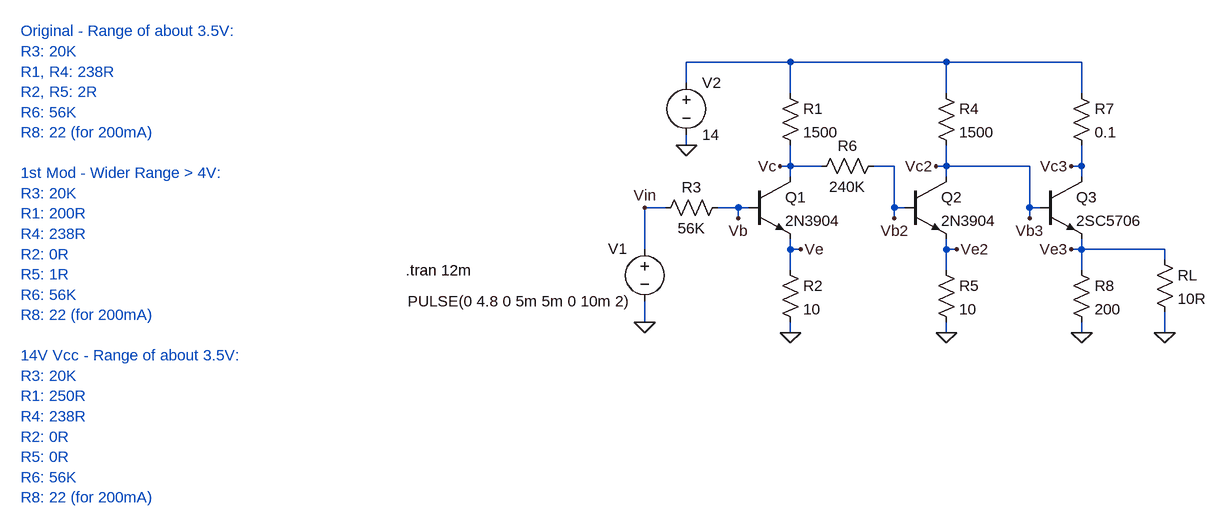
[diagram p0: schematic 2N3904 DC Amplifier  (10mA).asc]
2N3904 DC Amplifier  (10mA).asc, the LTspice schematic file:
Version 4
SHEET 1 1388 680
WIRE 192 -48 32 -48
WIRE 432 -48 192 -48
WIRE 640 -48 432 -48
WIRE 32 -16 32 -48
WIRE 192 0 192 -48
WIRE 432 0 432 -48
WIRE 640 0 640 -48
WIRE 32 80 32 64
WIRE 192 112 192 80
WIRE 192 112 176 112
WIRE 240 112 192 112
WIRE 352 112 320 112
WIRE 432 112 432 80
WIRE 432 112 416 112
WIRE 560 112 432 112
WIRE 640 112 640 80
WIRE 640 112 624 112
WIRE 192 128 192 112
WIRE 432 128 432 112
WIRE 640 128 640 112
WIRE 0 176 -32 176
WIRE 112 176 80 176
WIRE 128 176 112 176
WIRE 352 176 352 112
WIRE 368 176 352 176
WIRE 560 176 560 112
WIRE 576 176 560 176
WIRE 112 192 112 176
WIRE 352 192 352 176
WIRE 560 192 560 176
WIRE -32 240 -32 176
WIRE 192 240 192 224
WIRE 208 240 192 240
WIRE 432 240 432 224
WIRE 448 240 432 240
WIRE 640 240 640 224
WIRE 640 240 624 240
WIRE 768 240 640 240
WIRE 768 256 768 240
WIRE 192 272 192 240
WIRE 432 272 432 240
WIRE 640 272 640 240
WIRE -32 352 -32 320
WIRE 192 368 192 352
WIRE 432 368 432 352
WIRE 640 368 640 352
WIRE 768 368 768 336
FLAG 32 80 0
FLAG -32 352 0
FLAG 192 368 0
FLAG 176 112 Vc
FLAG 208 240 Ve
FLAG 112 192 Vb
FLAG -32 176 Vin
FLAG 432 368 0
FLAG 416 112 Vc2
FLAG 448 240 Ve2
FLAG 352 192 Vb2
FLAG 640 368 0
FLAG 624 112 Vc3
FLAG 624 240 Ve3
FLAG 560 192 Vb3
FLAG 768 368 0
SYMBOL npn 128 128 R0
SYMATTR InstName Q1
SYMATTR Value 2N3904
SYMBOL voltage -32 224 R0
WINDOW 0 -56 15 Left 2
WINDOW 3 -365 96 Left 2
WINDOW 123 -382 125 Left 2
WINDOW 39 0 0 Left 0
SYMATTR InstName V1
SYMATTR Value PULSE(0 4.8 0 5m 5m 0 10m 2)
SYMBOL voltage 32 -32 R0
WINDOW 123 0 0 Left 0
WINDOW 39 0 0 Left 0
SYMATTR InstName V2
SYMATTR Value 14
SYMBOL res 176 -16 R0
SYMATTR InstName R1
SYMATTR Value 1500
SYMBOL res 96 160 R90
WINDOW 0 0 56 VBottom 2
WINDOW 3 32 56 VTop 2
SYMATTR InstName R3
SYMATTR Value 56K
SYMBOL res 176 256 R0
SYMATTR InstName R2
SYMATTR Value 10
SYMBOL npn 368 128 R0
SYMATTR InstName Q2
SYMATTR Value 2N3904
SYMBOL res 416 -16 R0
SYMATTR InstName R4
SYMATTR Value 1500
SYMBOL res 416 256 R0
SYMATTR InstName R5
SYMATTR Value 10
SYMBOL res 336 96 R90
WINDOW 0 0 56 VBottom 2
WINDOW 3 32 56 VTop 2
SYMATTR InstName R6
SYMATTR Value 240K
SYMBOL npn 576 128 R0
SYMATTR InstName Q3
SYMATTR Value 2SC5706
SYMBOL res 624 -16 R0
SYMATTR InstName R7
SYMATTR Value 0.1
SYMBOL res 624 256 R0
SYMATTR InstName R8
SYMATTR Value 200
SYMBOL res 752 240 R0
SYMATTR InstName RL
SYMATTR Value 10R
TEXT -400 272 Left 2 !.tran 12m
TEXT -992 -96 Left 2 ;Original - Range of about 3.5V:\nR3: 20K\nR1, R4: 238R\nR2, R5: 2R\nR6: 56K\nR8: 22 (for 200mA)\n \n1st Mod - Wider Range > 4V:\nR3: 20K\nR1: 200R\nR4: 238R\nR2: 0R\nR5: 1R\nR6: 56K\nR8: 22 (for 200mA)\n \n14V Vcc - Range of about 3.5V:\nR3: 20K\nR1: 250R\nR4: 238R\nR2: 0R\nR5: 0R\nR6: 56K\nR8: 22 (for 200mA)

The netlist it stands for:
* 2N3904 DC Amplifier  (10mA).asc
Q1 Vc Vb Ve 0 2N3904
V1 Vin 0 PULSE(0 4.8 0 5m 5m 0 10m 2)
V2 N001 0 14
R1 N001 Vc 1500
R3 Vb Vin 56K
R2 Ve 0 10
Q2 Vb3 Vb2 Ve2 0 2N3904
R4 N001 Vb3 1500
R5 Ve2 0 10
R6 Vb2 Vc 240K
Q3 Vc3 Vb3 Ve3 0 2SC5706
R7 N001 Vc3 0.1
R8 Ve3 0 200
RL Ve3 0 10R
.model NPN NPN
.model PNP PNP
.lib standard.bjt
.tran 12m
* Original - Range of about 3.5V:
* R3: 20K
* R1, R4: 238R
* R2, R5: 2R
* R6: 56K
* R8: 22 (for 200mA)
* 1st Mod - Wider Range > 4V:
* R3: 20K
* R1: 200R
* R4: 238R
* R2: 0R
* R5: 1R
* R6: 56K
* R8: 22 (for 200mA)
* 14V Vcc - Range of about 3.5V:
* R3: 20K
* R1: 250R
* R4: 238R
* R2: 0R
* R5: 0R
* R6: 56K
* R8: 22 (for 200mA)
.backanno
.end